# Altium schematic sheet MPU-Memory.SchDoc
size C
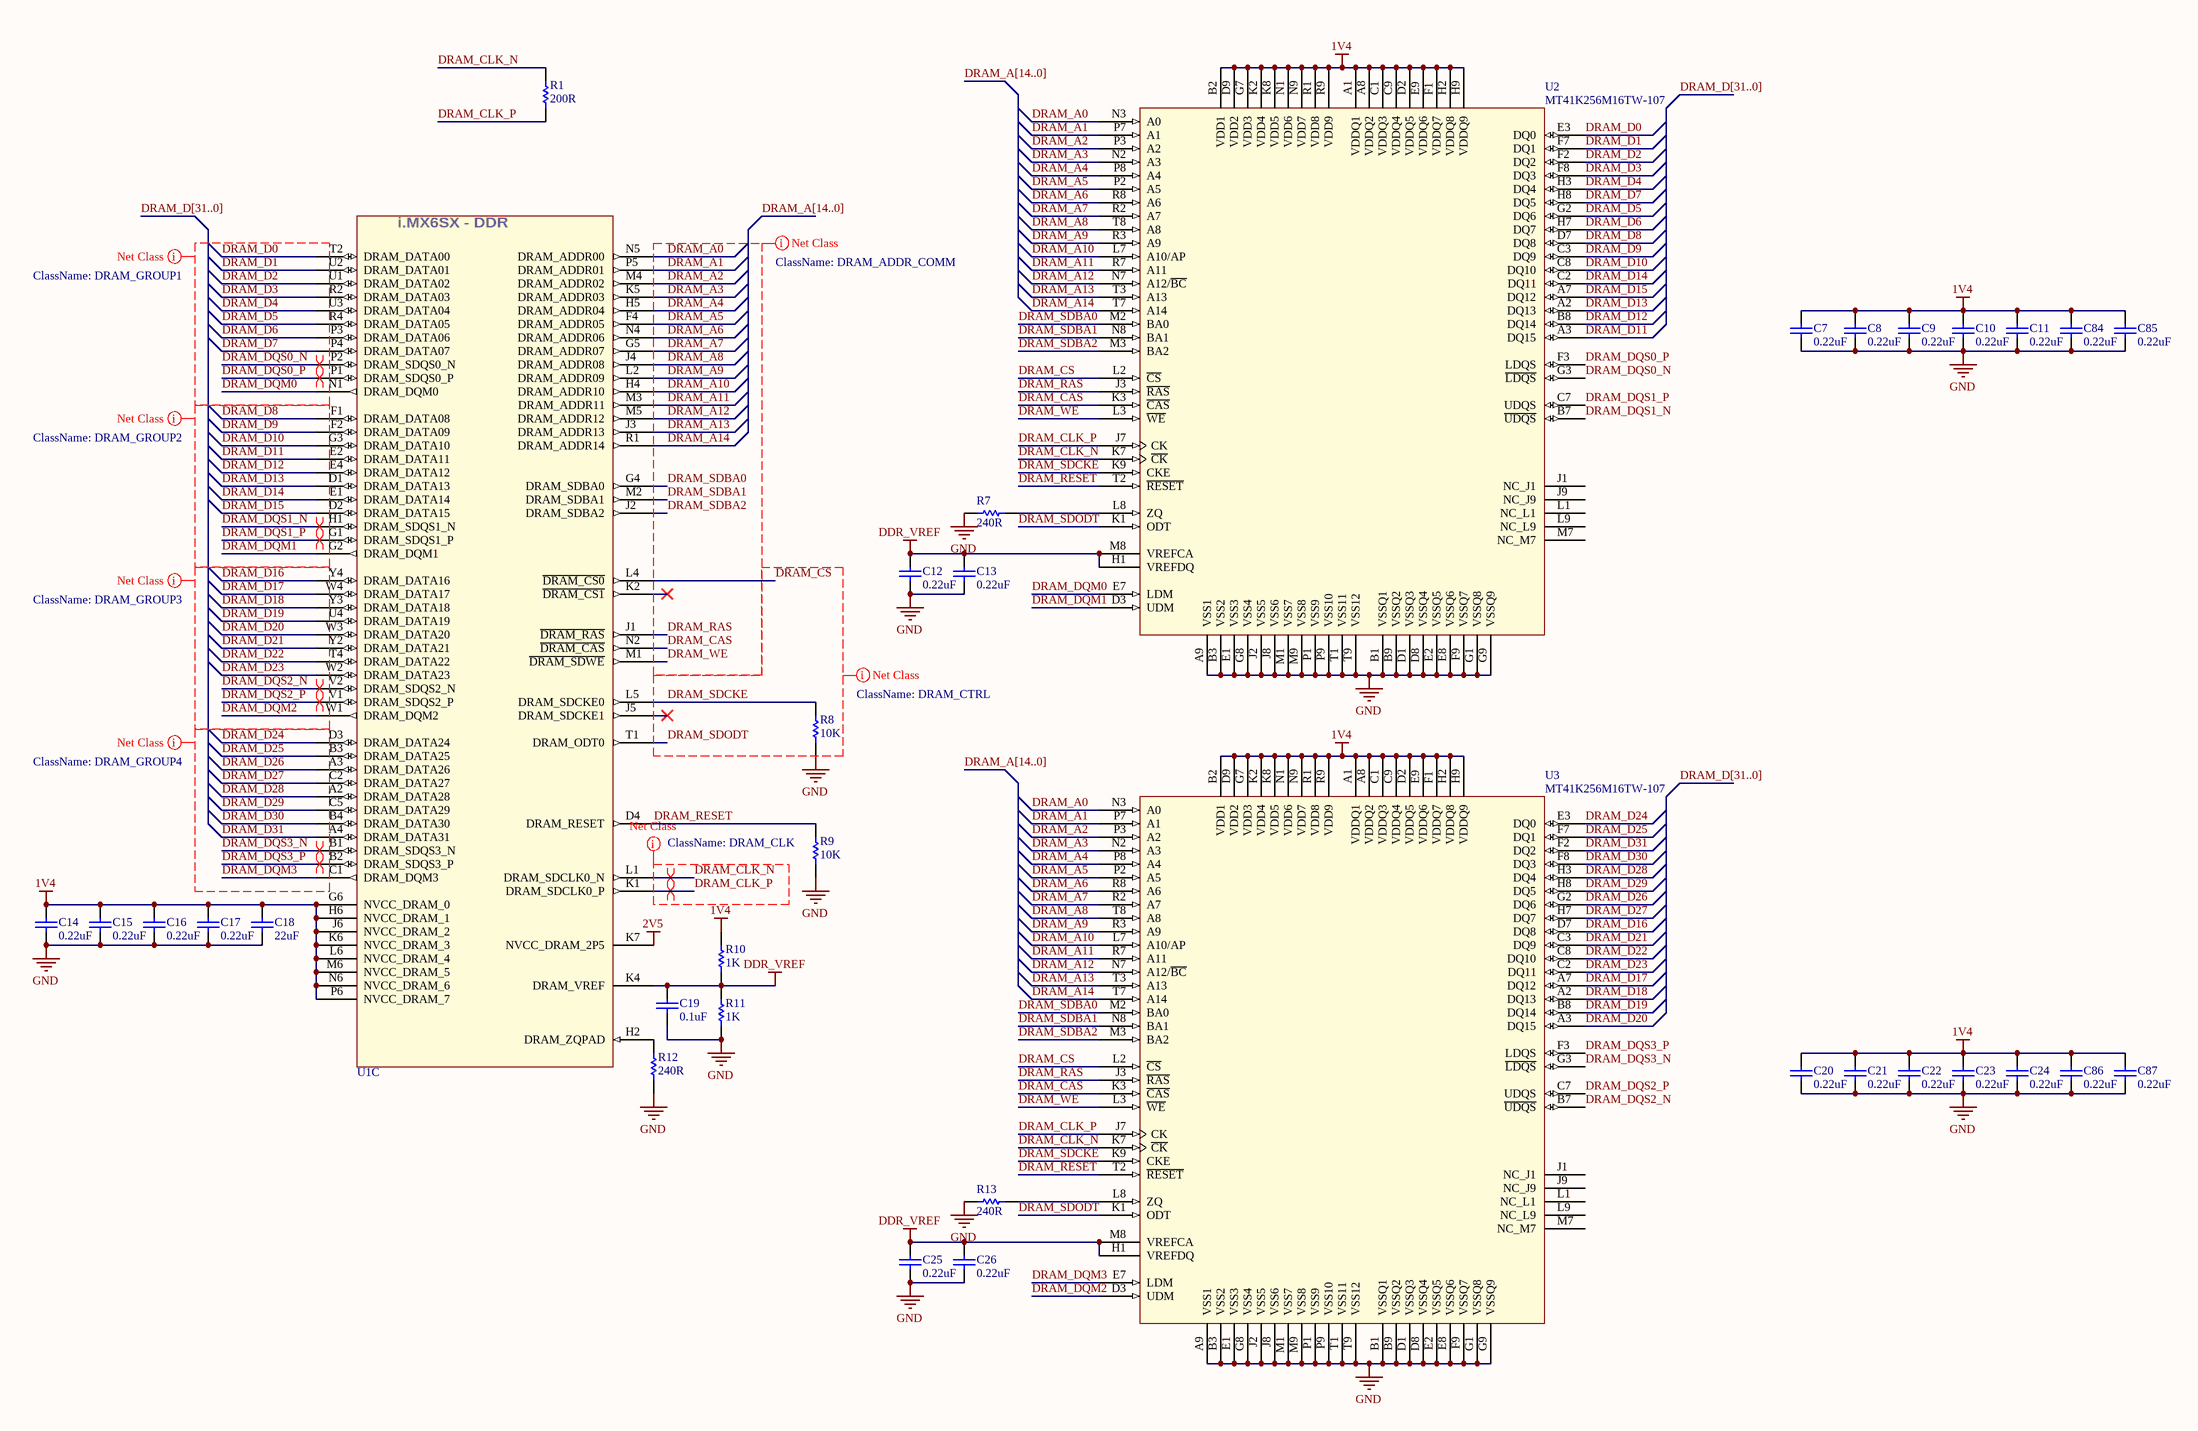
[diagram p0: MPU-Memory.SchDoc]

## Parts
C7  value 0.22uF  [C0402[1005X55]]  (hidden comment: 0.22uF 6.3V 0402)
C8  value 0.22uF  [C0402[1005X55]]  (hidden comment: 0.22uF 6.3V 0402)
C9  value 0.22uF  [C0402[1005X55]]  (hidden comment: 0.22uF 6.3V 0402)
C10  value 0.22uF  [C0402[1005X55]]  (hidden comment: 0.22uF 6.3V 0402)
C11  value 0.22uF  [C0402[1005X55]]  (hidden comment: 0.22uF 6.3V 0402)
C12  value 0.22uF  [C0402[1005X55]]  (hidden comment: 0.22uF 6.3V 0402)
C13  value 0.22uF  [C0402[1005X55]]  (hidden comment: 0.22uF 6.3V 0402)
C14  value 0.22uF  [C0402[1005X55]]  (hidden comment: 0.22uF 6.3V 0402)
C15  value 0.22uF  [C0402[1005X55]]  (hidden comment: 0.22uF 6.3V 0402)
C16  value 0.22uF  [C0402[1005X55]]  (hidden comment: 0.22uF 6.3V 0402)
C17  value 0.22uF  [C0402[1005X55]]  (hidden comment: 0.22uF 6.3V 0402)
C18  value 22uF  [C0603[1608X92]]  (hidden comment: 22uF 6.3V 0603)
C19  value 0.1uF  [C0402[1005X55]]  (hidden comment: 0.1uF 6.3V 0402)
C20  value 0.22uF  [C0402[1005X55]]  (hidden comment: 0.22uF 6.3V 0402)
C21  value 0.22uF  [C0402[1005X55]]  (hidden comment: 0.22uF 6.3V 0402)
C22  value 0.22uF  [C0402[1005X55]]  (hidden comment: 0.22uF 6.3V 0402)
C23  value 0.22uF  [C0402[1005X55]]  (hidden comment: 0.22uF 6.3V 0402)
C24  value 0.22uF  [C0402[1005X55]]  (hidden comment: 0.22uF 6.3V 0402)
C25  value 0.22uF  [C0402[1005X55]]  (hidden comment: 0.22uF 6.3V 0402)
C26  value 0.22uF  [C0402[1005X55]]  (hidden comment: 0.22uF 6.3V 0402)
C84  value 0.22uF  [C0402[1005X55]]  (hidden comment: 0.22uF 6.3V 0402)
C85  value 0.22uF  [C0402[1005X55]]  (hidden comment: 0.22uF 6.3V 0402)
C86  value 0.22uF  [C0402[1005X55]]  (hidden comment: 0.22uF 6.3V 0402)
C87  value 0.22uF  [C0402[1005X55]]  (hidden comment: 0.22uF 6.3V 0402)
R1  value 200R  [R0402[1005]]  (hidden comment: 200R 1% 0402)
R7  value 240R  [R0402[1005]]  (hidden comment: 240R 1% 0402)
R8  value 10K  [R0402[1005]]  (hidden comment: 10K 1% 0402)
R9  value 10K  [R0402[1005]]  (hidden comment: 10K 1% 0402)
R10  value 1K  [R0402[1005]]  (hidden comment: 1K 1% 0402)
R11  value 1K  [R0402[1005]]  (hidden comment: 1K 1% 0402)
R12  value 240R  [R0402[1005]]  (hidden comment: 240R 1% 0402)
R13  value 240R  [R0402[1005]]  (hidden comment: 240R 1% 0402)
U1  MCIMX6X3EVO10AB  [BGA-400]  (value not drawn)  (part C of 12)
U2  MT41K256M16TW-107  [BGA-96]
U3  MT41K256M16TW-107  [BGA-96]

## Nets
1V4: C7.2 C8.2 C9.2 C10.2 C11.2 C14.2 C15.2 C16.2 C17.2 C18.2 C20.2 C21.2 C22.2 C23.2 C24.2 C84.2 C85.2 C86.2 C87.2 R10.2 U1.G6(NVCC_DRAM_0) U1.H6(NVCC_DRAM_1) U1.J6(NVCC_DRAM_2) U1.K6(NVCC_DRAM_3) U1.L6(NVCC_DRAM_4) U1.M6(NVCC_DRAM_5) U1.N6(NVCC_DRAM_6) U1.P6(NVCC_DRAM_7) U2.A1(VDDQ1) U2.A8(VDDQ2) U2.B2(VDD1) U2.C1(VDDQ3) U2.C9(VDDQ4) U2.D2(VDDQ5) U2.D9(VDD2) U2.E9(VDDQ6) U2.F1(VDDQ7) U2.G7(VDD3) U2.H2(VDDQ8) U2.H9(VDDQ9) U2.K2(VDD4) U2.K8(VDD5) U2.N1(VDD6) U2.N9(VDD7) U2.R1(VDD8) U2.R9(VDD9) U3.A1(VDDQ1) U3.A8(VDDQ2) U3.B2(VDD1) U3.C1(VDDQ3) U3.C9(VDDQ4) U3.D2(VDDQ5) U3.D9(VDD2) U3.E9(VDDQ6) U3.F1(VDDQ7) U3.G7(VDD3) U3.H2(VDDQ8) U3.H9(VDDQ9) U3.K2(VDD4) U3.K8(VDD5) U3.N1(VDD6) U3.N9(VDD7) U3.R1(VDD8) U3.R9(VDD9)
2V5: U1.K7(NVCC_DRAM_2P5)
DDR_VREF: C12.2 C13.2 C19.2 C25.2 C26.2 R10.1 R11.2 U1.K4(DRAM_VREF) U2.H1(VREFDQ) U2.M8(VREFCA) U3.H1(VREFDQ) U3.M8(VREFCA)
GND: C7.1 C8.1 C9.1 C10.1 C11.1 C12.1 C13.1 C14.1 C15.1 C16.1 C17.1 C18.1 C19.1 C20.1 C21.1 C22.1 C23.1 C24.1 C25.1 C26.1 C84.1 C85.1 C86.1 C87.1 R7.2 R8.1 R9.1 R11.1 R12.1 R13.2 U2.A9(VSS1) U2.B1(VSSQ1) U2.B3(VSS2) U2.B9(VSSQ2) U2.D1(VSSQ3) U2.D8(VSSQ4) U2.E1(VSS3) U2.E2(VSSQ5) U2.E8(VSSQ6) U2.F9(VSSQ7) U2.G1(VSSQ8) U2.G8(VSS4) U2.G9(VSSQ9) U2.J2(VSS5) U2.J8(VSS6) U2.M1(VSS7) U2.M9(VSS8) U2.P1(VSS9) U2.P9(VSS10) U2.T1(VSS11) U2.T9(VSS12) U3.A9(VSS1) U3.B1(VSSQ1) U3.B3(VSS2) U3.B9(VSSQ2) U3.D1(VSSQ3) U3.D8(VSSQ4) U3.E1(VSS3) U3.E2(VSSQ5) U3.E8(VSSQ6) U3.F9(VSSQ7) U3.G1(VSSQ8) U3.G8(VSS4) U3.G9(VSSQ9) U3.J2(VSS5) U3.J8(VSS6) U3.M1(VSS7) U3.M9(VSS8) U3.P1(VSS9) U3.P9(VSS10) U3.T1(VSS11) U3.T9(VSS12)
DRAM_A0: U1.N5(DRAM_ADDR00) U2.N3(A0) U3.N3(A0)
DRAM_A1: U1.P5(DRAM_ADDR01) U2.P7(A1) U3.P7(A1)
DRAM_A2: U1.M4(DRAM_ADDR02) U2.P3(A2) U3.P3(A2)
DRAM_A3: U1.K5(DRAM_ADDR03) U2.N2(A3) U3.N2(A3)
DRAM_A4: U1.H5(DRAM_ADDR04) U2.P8(A4) U3.P8(A4)
DRAM_A5: U1.F4(DRAM_ADDR05) U2.P2(A5) U3.P2(A5)
DRAM_A6: U1.N4(DRAM_ADDR06) U2.R8(A6) U3.R8(A6)
DRAM_A7: U1.G5(DRAM_ADDR07) U2.R2(A7) U3.R2(A7)
DRAM_A8: U1.J4(DRAM_ADDR08) U2.T8(A8) U3.T8(A8)
DRAM_A9: U1.L2(DRAM_ADDR09) U2.R3(A9) U3.R3(A9)
DRAM_A10: U1.H4(DRAM_ADDR10) U2.L7(A10/AP) U3.L7(A10/AP)
DRAM_A11: U1.M3(DRAM_ADDR11) U2.R7(A11) U3.R7(A11)
DRAM_A12: U1.M5(DRAM_ADDR12) U2.N7(A12/~{BC}) U3.N7(A12/~{BC})
DRAM_A13: U1.J3(DRAM_ADDR13) U2.T3(A13) U3.T3(A13)
DRAM_A14: U1.R1(DRAM_ADDR14) U2.T7(A14) U3.T7(A14)
DRAM_CAS: U1.N2(~{DRAM_CAS}) U2.K3(~{CAS}) U3.K3(~{CAS})
DRAM_CLK_N: R1.2 U1.L1(DRAM_SDCLK0_N) U2.K7(~{CK}) U3.K7(~{CK})
DRAM_CLK_P: R1.1 U1.K1(DRAM_SDCLK0_P) U2.J7(CK) U3.J7(CK)
DRAM_CS: U1.L4(~{DRAM_CS0}) U2.L2(~{CS}) U3.L2(~{CS})
DRAM_D0: U1.T2(DRAM_DATA00) U2.E3(DQ0)
DRAM_D1: U1.U2(DRAM_DATA01) U2.F7(DQ1)
DRAM_D2: U1.U1(DRAM_DATA02) U2.F2(DQ2)
DRAM_D3: U1.R2(DRAM_DATA03) U2.F8(DQ3)
DRAM_D4: U1.U3(DRAM_DATA04) U2.H3(DQ4)
DRAM_D5: U1.R4(DRAM_DATA05) U2.G2(DQ6)
DRAM_D6: U1.P3(DRAM_DATA06) U2.H7(DQ7)
DRAM_D7: U1.P4(DRAM_DATA07) U2.H8(DQ5)
DRAM_D8: U1.F1(DRAM_DATA08) U2.D7(DQ8)
DRAM_D9: U1.F2(DRAM_DATA09) U2.C3(DQ9)
DRAM_D10: U1.G3(DRAM_DATA10) U2.C8(DQ10)
DRAM_D11: U1.E2(DRAM_DATA11) U2.A3(DQ15)
DRAM_D12: U1.E4(DRAM_DATA12) U2.B8(DQ14)
DRAM_D13: U1.D1(DRAM_DATA13) U2.A2(DQ13)
DRAM_D14: U1.E1(DRAM_DATA14) U2.C2(DQ11)
DRAM_D15: U1.D2(DRAM_DATA15) U2.A7(DQ12)
DRAM_D16: U1.Y4(DRAM_DATA16) U3.D7(DQ8)
DRAM_D17: U1.W4(DRAM_DATA17) U3.A7(DQ12)
DRAM_D18: U1.Y3(DRAM_DATA18) U3.A2(DQ13)
DRAM_D19: U1.U4(DRAM_DATA19) U3.B8(DQ14)
DRAM_D20: U1.W3(DRAM_DATA20) U3.A3(DQ15)
DRAM_D21: U1.Y2(DRAM_DATA21) U3.C3(DQ9)
DRAM_D22: U1.T4(DRAM_DATA22) U3.C8(DQ10)
DRAM_D23: U1.W2(DRAM_DATA23) U3.C2(DQ11)
DRAM_D24: U1.D3(DRAM_DATA24) U3.E3(DQ0)
DRAM_D25: U1.B3(DRAM_DATA25) U3.F7(DQ1)
DRAM_D26: U1.A3(DRAM_DATA26) U3.G2(DQ6)
DRAM_D27: U1.C2(DRAM_DATA27) U3.H7(DQ7)
DRAM_D28: U1.A2(DRAM_DATA28) U3.H3(DQ4)
DRAM_D29: U1.C5(DRAM_DATA29) U3.H8(DQ5)
DRAM_D30: U1.B4(DRAM_DATA30) U3.F8(DQ3)
DRAM_D31: U1.A4(DRAM_DATA31) U3.F2(DQ2)
DRAM_DQM0: U1.N1(DRAM_DQM0) U2.E7(LDM)
DRAM_DQM1: U1.G2(DRAM_DQM1) U2.D3(UDM)
DRAM_DQM2: U1.W1(DRAM_DQM2) U3.D3(UDM)
DRAM_DQM3: U1.C1(DRAM_DQM3) U3.E7(LDM)
DRAM_DQS0_N: U1.P2(DRAM_SDQS0_N) U2.G3(~{LDQS})
DRAM_DQS0_P: U1.P1(DRAM_SDQS0_P) U2.F3(LDQS)
DRAM_DQS1_N: U1.H1(DRAM_SDQS1_N) U2.B7(~{UDQS})
DRAM_DQS1_P: U1.G1(DRAM_SDQS1_P) U2.C7(UDQS)
DRAM_DQS2_N: U1.V2(DRAM_SDQS2_N) U3.B7(~{UDQS})
DRAM_DQS2_P: U1.V1(DRAM_SDQS2_P) U3.C7(UDQS)
DRAM_DQS3_N: U1.B1(DRAM_SDQS3_N) U3.G3(~{LDQS})
DRAM_DQS3_P: U1.B2(DRAM_SDQS3_P) U3.F3(LDQS)
DRAM_RAS: U1.J1(~{DRAM_RAS}) U2.J3(~{RAS}) U3.J3(~{RAS})
DRAM_RESET: R9.2 U1.D4(DRAM_RESET) U2.T2(~{RESET}) U3.T2(~{RESET})
DRAM_SDBA0: U1.G4(DRAM_SDBA0) U2.M2(BA0) U3.M2(BA0)
DRAM_SDBA1: U1.M2(DRAM_SDBA1) U2.N8(BA1) U3.N8(BA1)
DRAM_SDBA2: U1.J2(DRAM_SDBA2) U2.M3(BA2) U3.M3(BA2)
DRAM_SDCKE: R8.2 U1.L5(DRAM_SDCKE0) U2.K9(CKE) U3.K9(CKE)
DRAM_SDODT: U1.T1(DRAM_ODT0) U2.K1(ODT) U3.K1(ODT)
DRAM_WE: U1.M1(~{DRAM_SDWE}) U2.L3(~{WE}) U3.L3(~{WE})
NetR7_1: R7.1 U2.L8(ZQ)
NetR12_2: R12.2 U1.H2(DRAM_ZQPAD)
NetR13_1: R13.1 U3.L8(ZQ)

Not connected (* = marked no-connect by the designer): U1 J5(DRAM_SDCKE1)* K2(~{DRAM_CS1})*; U2 J1(NC_J1) J9(NC_J9) L1(NC_L1) L9(NC_L9) M7(NC_M7); U3 J1(NC_J1) J9(NC_J9) L1(NC_L1) L9(NC_L9) M7(NC_M7)

## Buses and harness runs
bus DRAM_A[14..0]
bus DRAM_D[31..0]

## Layout directives
differential pair: DRAM_CLK_N, DRAM_CLK_P, DRAM_DQS0_N, DRAM_DQS0_P, DRAM_DQS1_N, DRAM_DQS1_P, DRAM_DQS2_N, DRAM_DQS2_P, DRAM_DQS3_N, DRAM_DQS3_P
net class DRAM_GROUP1: DRAM_D0, DRAM_D1, DRAM_D2, DRAM_D3, DRAM_D4, DRAM_D5, DRAM_D6, DRAM_D7, DRAM_DQM0, DRAM_DQS0_N, DRAM_DQS0_P
net class DRAM_GROUP2: DRAM_D8, DRAM_D9, DRAM_D10, DRAM_D11, DRAM_D12, DRAM_D13, DRAM_D14, DRAM_D15, DRAM_DQM1, DRAM_DQS1_N, DRAM_DQS1_P
net class DRAM_GROUP3: DRAM_D16, DRAM_D17, DRAM_D18, DRAM_D19, DRAM_D20, DRAM_D21, DRAM_D22, DRAM_D23, DRAM_DQM2, DRAM_DQS2_N, DRAM_DQS2_P
net class DRAM_GROUP4: DRAM_D24, DRAM_D25, DRAM_D26, DRAM_D27, DRAM_D28, DRAM_D29, DRAM_D30, DRAM_D31, DRAM_DQM3, DRAM_DQS3_N, DRAM_DQS3_P
net class DRAM_ADDR_COMM: DRAM_A0, DRAM_A1, DRAM_A2, DRAM_A3, DRAM_A4, DRAM_A5, DRAM_A6, DRAM_A7, DRAM_A8, DRAM_A9, DRAM_A10, DRAM_A11, DRAM_A12, DRAM_A13, DRAM_A14, DRAM_CAS, DRAM_RAS, DRAM_SDBA0, DRAM_SDBA1, DRAM_SDBA2, DRAM_WE
net class DRAM_CTRL: DRAM_CS, DRAM_SDCKE, DRAM_SDODT, GND
net class DRAM_CLK: DRAM_CLK_N, DRAM_CLK_P

## Notes on the sheet
- (in symbol MCIMX6X3EVO10AB, part C) i.MX6SX - DDR

## Library data of the parts
C7-C17 C20-C26 C84-C87 = CAP_0.22uF_6.3V_0402_10%: 0.22uF 6.3V 10% 0402 (1005 Metric); PartNumber: JMK105BJ224KV-F; Manufacturer: Taiyo Yuden; Mounting Technology: Surface Mount; PackageReference: 0402; PackageDescription: 0402 (1005 Metric); Voltage: 6.3V; Tolerance: 10%
C18 = CAP_22uF_6.3V_0603_10%: 22uF 6.3V 10% 0603 (1608 Metric); PartNumber: GRT188R60J226ME13D; Manufacturer: Murata; Mounting Technology: Surface Mount; PackageReference: 0603; PackageDescription: 0603 (1608 Metric); Voltage: 6.3V; Tolerance: 10%
C19 = CAP_0.1uF_6.3V_0402_10%: 0.1uF 6.3V 10% 0402 (1005 Metric); PartNumber: GRM155R70J104KA01D; Manufacturer: Murata; Mounting Technology: Surface Mount; PackageReference: 0402; PackageDescription: 0402 (1005 Metric); Voltage: 6.3V; Tolerance: 10%
R1 = RES_200R_0402_1%: 200R 0.063W 1% 0402 (1005 Metric); Manufacturer: KOA Speer; PartNumber: RK73H1ETTP2000F; Tolerance: 1%; Power: 0.063W; Mounting Technology: Surface Mount; PackageReference: 0402; PackageDescription: 0402 (1005 Metric); ComponentLink1Description: Datasheet; ComponentLink1URL: http://www.koaspeer.com/catimages/Products/RK73H/RK73H.pdf
R7 R12 R13 = RES_240R_0402_1%: 240R 0.063W 1% 0402 (1005 Metric); Manufacturer: KOA Speer; PartNumber: RK73H1ETTP2400F; Tolerance: 1%; Power: 0.063W; Mounting Technology: Surface Mount; PackageReference: 0402; PackageDescription: 0402 (1005 Metric); ComponentLink1Description: Datasheet; ComponentLink1URL: http://www.koaspeer.com/catimages/Products/RK73H/RK73H.pdf
R8 R9 = RES_10K_0402_1%: 10K 0.063W 1% 0402 (1005 Metric); Manufacturer: KOA Speer; PartNumber: RK73H1ETTP1002F; Tolerance: 1%; Power: 0.063W; Mounting Technology: Surface Mount; PackageReference: 0402; PackageDescription: 0402 (1005 Metric); ComponentLink1Description: Datasheet; ComponentLink1URL: http://www.koaspeer.com/catimages/Products/RK73H/RK73H.pdf
R10 R11 = RES_1K_0402_1%: 1K 0.063W 1% 0402 (1005 Metric); Manufacturer: KOA Speer; PartNumber: RK73H1ETTP1001F; Tolerance: 1%; Power: 0.063W; Mounting Technology: Surface Mount; PackageReference: 0402; PackageDescription: 0402 (1005 Metric); ComponentLink1Description: Datasheet; ComponentLink1URL: http://www.koaspeer.com/catimages/Products/RK73H/RK73H.pdf
U1 = MCIMX6X3EVO10AB: IC MPU I.MX6SX 1GHZ 400MAPBGA; Manufacturer: NXP; PartNumber: MCIMX6X3EVO10AB; Mounting Technology: Surface Mount; PackageReference: BGA-400
U2 U3 = MT41K256M16TW-107: IC SDRAM 4GBIT 933MHZ 96FBGA; Manufacturer: Micron Technology; PartNumber: MT41K256M16TW-107; Mounting Technology: Surface Mount; PackageReference: BGA-96